# EAGLE design atmega_fusebit_doctor_V2g (EAGLE 5.10)
AUTHOR: PAWEL KISIELEWSKI (MANEKINEN); REV: 2.0
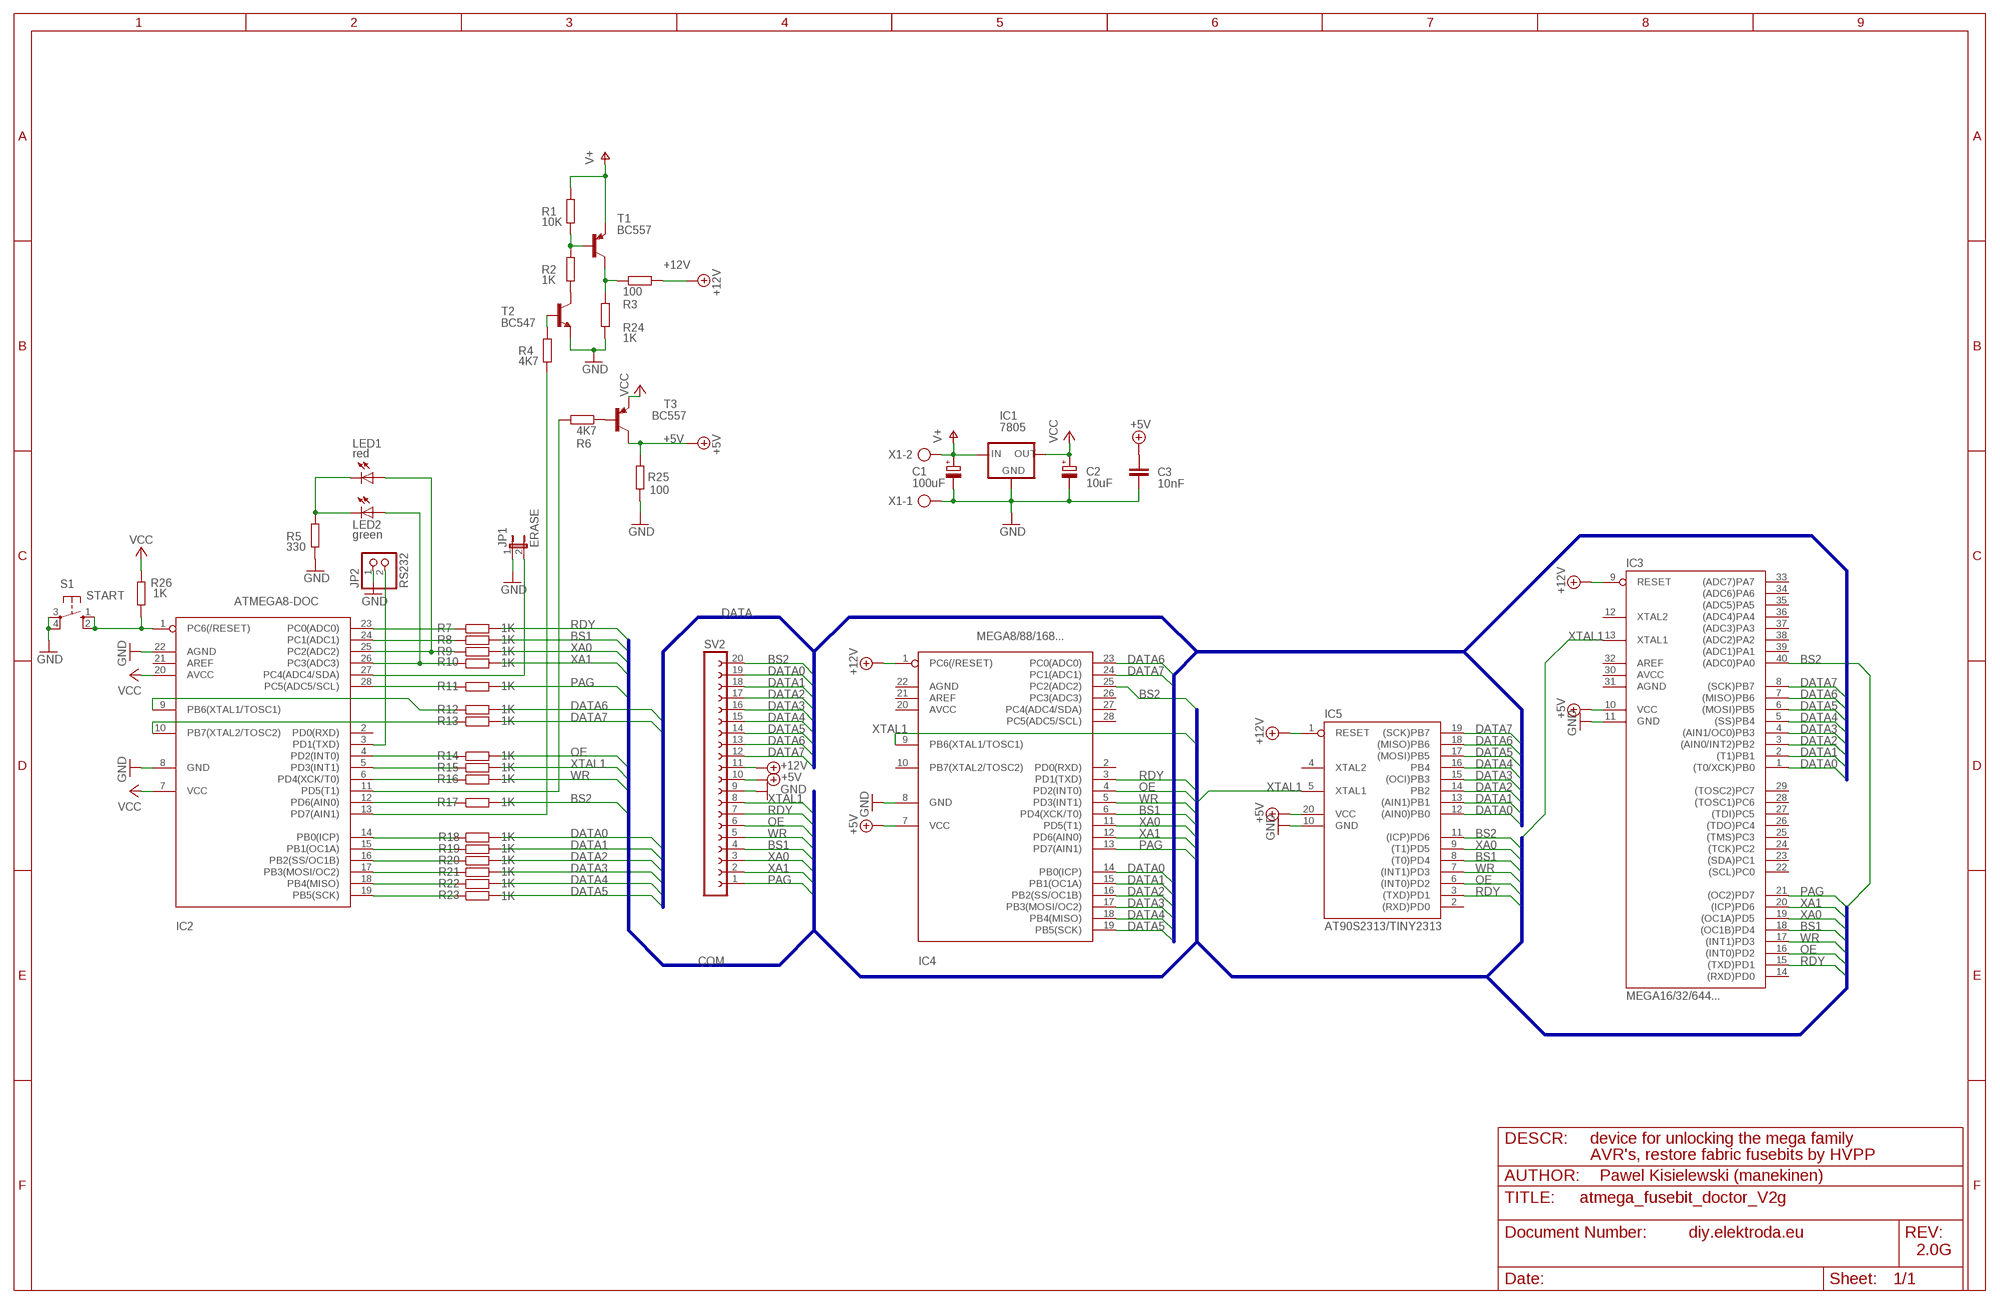
[diagram p0: schematic, sheet 1]

## Parts
C1  100uF  CPOL-EUE2.5-5  [E2,5-5]
C2  10uF  CPOL-EUE2.5-5  [E2,5-5]
C3  10nF  C-EU050-024X044  [C050-024X044]
IC1  7805  78XXL  [78XXL]
IC2  ATMEGA8-DOC  MEGA8-P  [DIL28-3]
IC3  MEGA16/32/644...  MEGA16-P  [DIL40]
IC4  MEGA8/88/168...  MEGA8-P  [DIL28-3]
IC5  AT90S2313/TINY2313  AT90S2313P  [DIL20]
JP1  ERASE  JP1E  [JP1]
JP2  RS232  PINHD-1X2  [1X02]
LED1  red  LED3MM  [LED3MM]
LED2  green  LED3MM  [LED3MM]
R1  10K  R-EU_0204/5  [0204/5]
R2  1K  R-EU_0204/5  [0204/5]
R3  100  R-EU_0204/5  [0204/5]
R4  4K7  R-EU_0204/5  [0204/5]
R5  330  R-EU_0204/5  [0204/5]
R6  4K7  R-EU_0204/5  [0204/5]
R7  1K  R-EU_0204/5  [0204/5]
R8  1K  R-EU_0204/5  [0204/5]
R9  1K  R-EU_0204/5  [0204/5]
R10  1K  R-EU_0204/5  [0204/5]
R11  1K  R-EU_0204/5  [0204/5]
R12  1K  R-EU_0204/5  [0204/5]
R13  1K  R-EU_0204/5  [0204/5]
R14  1K  R-EU_0204/5  [0204/5]
R15  1K  R-EU_0204/5  [0204/5]
R16  1K  R-EU_0204/5  [0204/5]
R17  1K  R-EU_0204/5  [0204/5]
R18  1K  R-EU_0204/5  [0204/5]
R19  1K  R-EU_0204/5  [0204/5]
R20  1K  R-EU_0204/5  [0204/5]
R21  1K  R-EU_0204/5  [0204/5]
R22  1K  R-EU_0204/5  [0204/5]
R23  1K  R-EU_0204/5  [0204/5]
R24  1K  R-EU_0204/5  [0204/5]
R25  100  R-EU_0204/5  [0204/5]
R26  1K  R-EU_0204/5  [0204/5]
S1  START  10-XX  [B3F-10XX]
SV2  FE20-1  [FE20]
T1  BC557  BC557C-PNP-TO92-EBC  [TO92-EBC]
T2  BC547  BC547A-NPN-TO92-EBC  [TO92-EBC]
T3  BC557  BC557C-PNP-TO92-EBC  [TO92-EBC]
X1  AK500/2  [AK500/2]

## Nets
+5V: C3.1 IC3.10(VCC) IC4.7(VCC) IC5.20(VCC) R25.2 SV2.10 T3.C
+12V: IC3.9(RESET) IC4.1(PC6(/RESET)) IC5.1(RESET) R3.2 SV2.11
BS1: IC3.18((OC1B)PD4) IC4.6(PD4(XCK/T0)) IC5.8((T0)PD4) R8.2 SV2.4
BS2: IC3.40((ADC0)PA0) IC4.25(PC2(ADC2)) IC5.11((ICP)PD6) R17.2 SV2.20
DATA0: IC3.1((T0/XCK)PB0) IC4.14(PB0(ICP)) IC5.12((AIN0)PB0) R18.2 SV2.19
DATA1: IC3.2((T1)PB1) IC4.15(PB1(OC1A)) IC5.13((AIN1)PB1) R19.2 SV2.18
DATA2: IC3.3((AIN0/INT2)PB2) IC4.16(PB2(SS/OC1B)) IC5.14(PB2) R20.2 SV2.17
DATA3: IC3.4((AIN1/OC0)PB3) IC4.17(PB3(MOSI/OC2)) IC5.15((OCI)PB3) R21.2 SV2.16
DATA4: IC3.5((SS)PB4) IC4.18(PB4(MISO)) IC5.16(PB4) R22.2 SV2.15
DATA5: IC3.6((MOSI)PB5) IC4.19(PB5(SCK)) IC5.17((MOSI)PB5) R23.2 SV2.14
DATA6: IC3.7((MISO)PB6) IC4.23(PC0(ADC0)) IC5.18((MISO)PB6) R12.2 SV2.13
DATA7: IC3.8((SCK)PB7) IC4.24(PC1(ADC1)) IC5.19((SCK)PB7) R13.2 SV2.12
GND: C1.- C2.- C3.2 IC1.GND IC2.8(GND) IC2.22(AGND) IC3.11(GND) IC4.8(GND) IC5.10(GND) JP1.1 JP2.1 R5.1 R24.1 R25.1 S1.3(P) S1.4(P1) SV2.9 T2.E X1.1
N$1: R6.1 T3.B
N$2: IC2.14(PB0(ICP)) R18.1
N$3: IC2.3(PD1(TXD)) JP2.2
N$4: IC2.28(PC5(ADC5/SCL)) R11.1
N$5: IC2.6(PD4(XCK/T0)) R16.1
N$6: IC2.4(PD2(INT0)) R14.1
N$8: R2.2 T2.C
N$9: IC2.9(PB6(XTAL1/TOSC1)) R12.1
N$10: IC2.10(PB7(XTAL2/TOSC2)) R13.1
N$11: IC2.13(PD7(AIN1)) R4.2
N$12: IC2.11(PD5(T1)) R6.2
N$14: IC2.15(PB1(OC1A)) R19.1
N$16: IC2.16(PB2(SS/OC1B)) R20.1
N$19: IC2.5(PD3(INT1)) R15.1
N$21: IC2.23(PC0(ADC0)) R7.1
N$22: R3.1 R24.2 T1.C
N$24: IC2.17(PB3(MOSI/OC2)) R21.1
N$25: IC2.18(PB4(MISO)) R22.1
N$26: IC2.19(PB5(SCK)) R23.1
N$27: IC2.12(PD6(AIN0)) R17.1
N$29: R4.1 T2.B
N$31: IC2.27(PC4(ADC4/SDA)) JP1.2
N$32: LED1.K(C) LED2.K(C) R5.2
N$34: R1.2 R2.1 T1.B
N$42: IC2.24(PC1(ADC1)) R8.1
N$43: IC2.1(PC6(/RESET)) R26.1 S1.1(S) S1.2(S1)
N$47: IC2.26(PC3(ADC3)) LED2.A R10.1
N$48: IC2.25(PC2(ADC2)) LED1.A R9.1
OE: IC3.16((INT0)PD2) IC4.4(PD2(INT0)) IC5.6((INT0)PD2) R14.2 SV2.6
PAG: IC3.21((OC2)PD7) IC4.13(PD7(AIN1)) R11.2 SV2.1
RDY: IC3.15((TXD)PD1) IC4.3(PD1(TXD)) IC5.3((TXD)PD1) R7.2 SV2.7
V+: C1.+ IC1.IN R1.1 T1.E X1.2
VCC: C2.+ IC1.OUT IC2.7(VCC) IC2.20(AVCC) R26.2 T3.E
WR: IC3.17((INT1)PD3) IC4.5(PD3(INT1)) IC5.7((INT1)PD3) R16.2 SV2.5
XA0: IC3.19((OC1A)PD5) IC4.11(PD5(T1)) IC5.9((T1)PD5) R9.2 SV2.3
XA1: IC3.20((ICP)PD6) IC4.12(PD6(AIN0)) R10.2 SV2.2
XTAL1: IC3.13(XTAL1) IC4.9(PB6(XTAL1/TOSC1)) IC5.5(XTAL1) R15.2 SV2.8
Unconnected: IC2.2(PD0(RXD)) IC2.21(AREF) IC3.12(XTAL2) IC3.14((RXD)PD0) IC3.22((SCL)PC0) IC3.23((SDA)PC1) IC3.24((TCK)PC2) IC3.25((TMS)PC3) IC3.26((TDO)PC4) IC3.27((TDI)PC5) IC3.28((TOSC1)PC6) IC3.29((TOSC2)PC7) IC3.33((ADC7)PA7) IC3.34((ADC6)PA6) IC3.35((ADC5)PA5) IC3.36((ADC4)PA4) IC3.37((ADC3)PA3) IC3.38((ADC2)PA2) IC3.39((ADC1)PA1) IC4.2(PD0(RXD)) IC4.10(PB7(XTAL2/TOSC2)) IC4.20(AVCC) IC4.21(AREF) IC4.22(AGND) IC4.26(PC3(ADC3)) IC4.27(PC4(ADC4/SDA)) IC4.28(PC5(ADC5/SCL)) IC5.2((RXD)PD0) IC5.4(XTAL2)

## Buses
DATA
COM

## Notes on the sheet
- DESCR: | device for unlocking the mega family
- AVR's, restore fabric fusebits by HVPP
- AUTHOR: | Pawel Kisielewski (manekinen)
- diy.elektroda.eu
- 2.0G

## Power pins joined to a net without a drawn wire
AGND: IC3.31(AGND)
AREF: IC3.32(AREF)
AVCC: IC3.30(AVCC)

## Library data of the parts
C1 C2 = rcl:CPOL-EU: POLARIZED CAPACITOR, European symbol
C3 = rcl:C-EU: CAPACITOR, European symbol
IC1 = v-reg:78XXL: VOLTAGE REGULATOR
IC2 IC4 = atmel:MEGA8-P: MICROCONTROLLER 8 Kbytes FLASH 1 kbytes SRAM 512 bytes EEPROM USART 4-channel 10 bit ADC 2-channel 8 bit ADC Source: avr.lbr
IC3 = atmel:MEGA16-P: MICROCONTROLLER 16 Kbytes FLASH 1 kbytes SRAM 512 bytes EEPROM USART 8-channel 10 bit ADC Source: avr.lbr
IC5 = atmel:AT90S2313: MICROCONTROLLER 2 Kbytes FLASH 128 bytes SRAM 128 bytes EEPROM UART
JP1 = jumper:JP1E: JUMPER
JP2 = pinhead:PINHD-1X2: PIN HEADER
LED1 LED2 = led:LED: LED OSRAM: - CHIPLED LG R971, LG N971, LY N971, LG Q971, LY Q971, LO R971, LY R971 LH N974, LH R974 LS Q976, LO Q976, LY Q976 LO Q996 - Hyper CHIPLED LW Q18S LB Q993, LB Q99A, LB R99A - SideLED LS A670, LO A670, LY A670, LG A670, LP A670 LB A673, LV A673, LT A673, LW A673 LH A674 LY A675 LS A676, LA A676, LO A676, LY A676, LW A676 LS A679, LY A679, LG A679 - Hyper Micro SIDELED® LS Y876, LA Y876, LO Y876, LY Y876 LT Y87S - SmartLED LW L88C, LW L88S LB L89C, LB L89S, LG L890 LS L89K, LO L89K, LY L89K LS L896, LA L896, LO L896, LY L896 - TOPLED LS T670, LO T670, LY T670, LG T670, LP T670 LSG T670, LSP T670, LSY T670, LOP T670, LYG T670 LG T671, LOG T671, LSG T671 LB T673, LV T673, LT T673, LW T673 LH T674 LS T676, LA T676, LO T676, LY T676, LB T676, LH T676, LSB T676, LW T676 LB T67C, LV T67C, LT T67C, LS T67K, LO T67K, LY T67K, LW E67C LS E67B, LA E67B, LO E67B, LY E67B, LB E67C, LV E67C, LT E67C LW T67C LS T679, LY T679, LG T679 LS T770, LO T770, LY T770, LG T770, LP T770 LB T773, LV T773, LT T773, LW T773 LH T774 LS E675, LA E675, LY E675, LS T675 LS T776, LA T776, LO T776, LY T776, LB T776 LHGB T686 LT T68C, LB T68C - Hyper Mini TOPLED® LB M676 - Mini TOPLED Santana® LG M470 LS M47K, LO M47K, LY M47K Source: http://www.osram.convergy.de - LUMILED® LXK2-PW12-R00, LXK2-PW12-S00, LXK2-PW14-U00, LXK2-PW14-V00 LXK2-PM12-R00, LXK2-PM12-S00, LXK2-PM14-U00 LXK2-PE12-Q00, LXK2-PE12-R00, LXK2-PE12-S00, LXK2-PE14-T00, LXK2-PE14-U00 LXK2-PB12-K00, LXK2-PB12-L00, LXK2-PB12-M00, LXK2-PB14-N00, LXK2-PB14-P00, LXK2-PB14-Q00 LXK2-PR12-L00, LXK2-PR12-M00, LXK2-PR14-Q00, LXK2-PR14-R00 LXK2-PD12-Q00, LXK2-PD12-R00, LXK2-PD12-S00 LXK2-PH12-R00, LXK2-PH12-S00 LXK2-PL12-P00, LXK2-PL12-Q00, LXK2-PL12-R00 Source: www.luxeon.com
R1-R26 = rcl:R-EU_: RESISTOR, European symbol
S1 = switch-omron:10-XX: OMRON SWITCH
SV2 = con-lsta:FE20-1: FEMALE HEADER
T1 T3 = transistor:*-PNP-: PNP Transistror
T2 = transistor:*-NPN-: NPN Transistror
X1 = con-ptr500:AK500/2: CONNECTOR

## Board
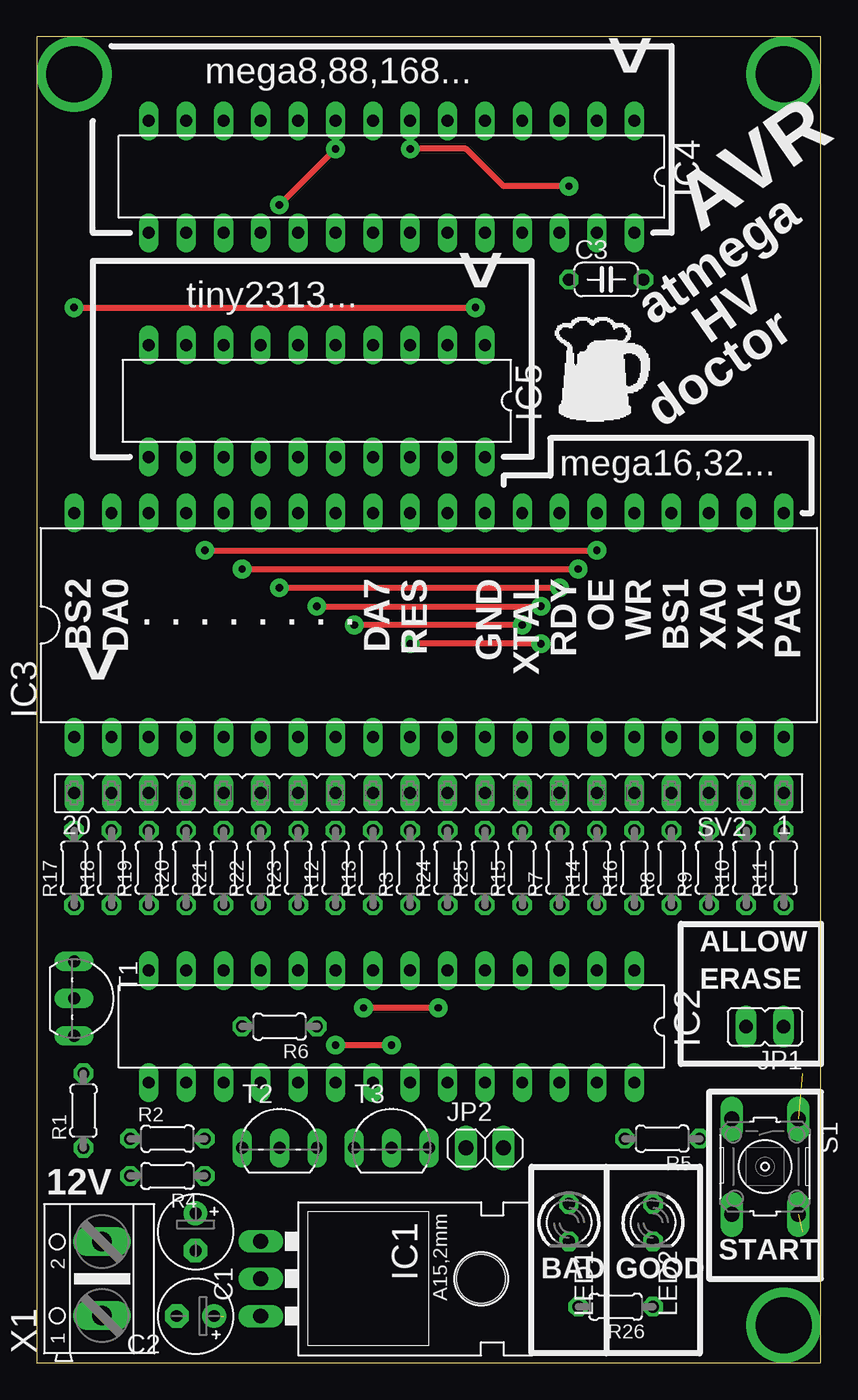
[diagram p1: board, top side]
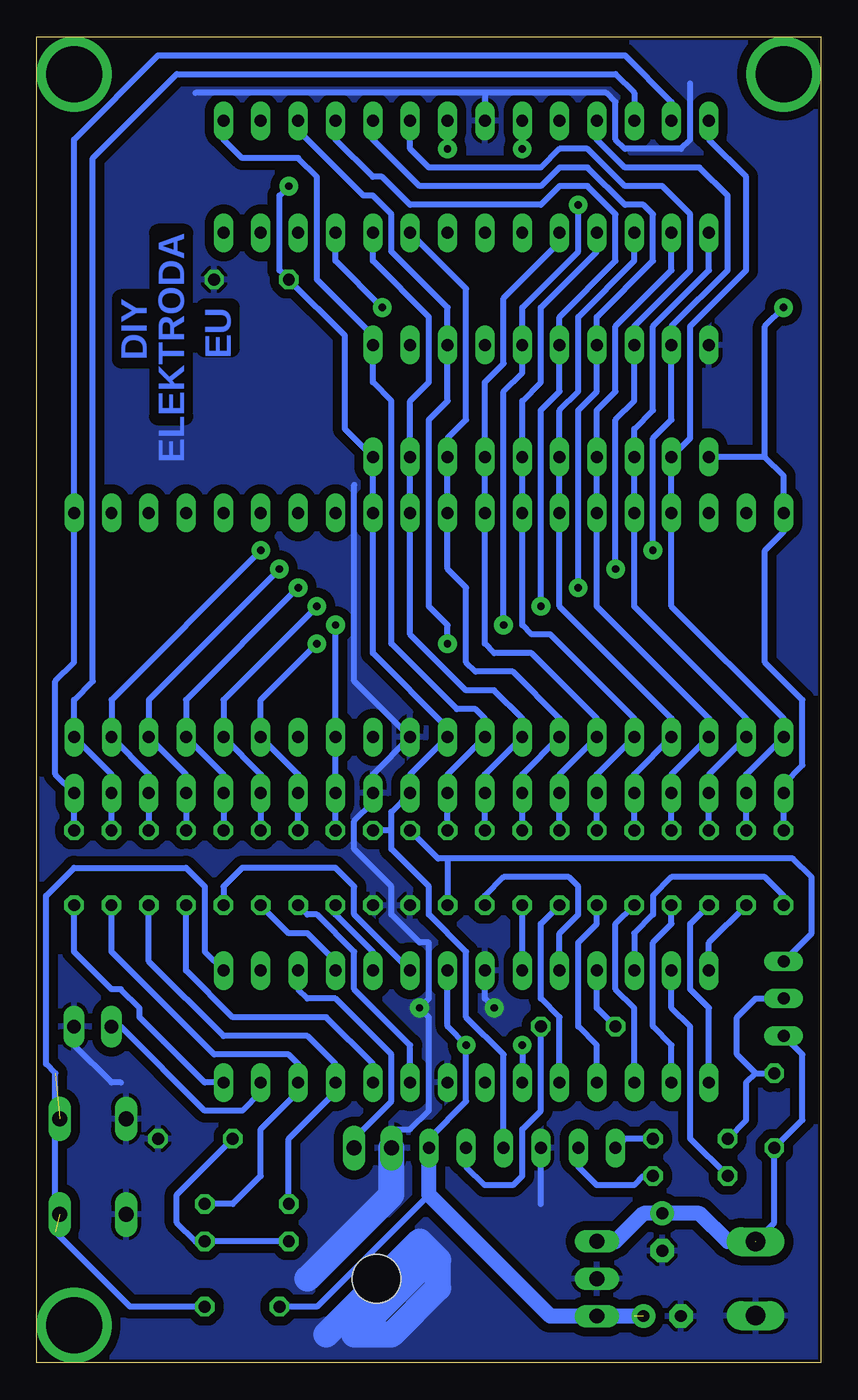
[diagram p2: board, bottom side, seen from below]

Size 53.33 x 90.16 mm. Coordinates in mm from the lower left corner, seen from the top.
Outline: 0,90.16 0,0 53.33,0 53.33,90.16 0,90.16
Copper layers (1*16): Top 0.035mm / dielectric 1.5mm / Bottom 0.035mm
Design rules "default *": minimum track width 10mil, minimum drill 24mil, track to track 24mil, track to pad 24mil, pad to pad 8mil, via to via 8mil, smd to smd 8mil, copper to edge 8mil, drill to drill 8mil, minimum pad ring 10mil, minimum via ring 8mil, stop-mask expansion 4mil, vias tented up to drill 0mil, thermal gap 10mil

### Footprints (pad centres in the part's own frame; a part is rotated, then mirrored left to right if it is on the bottom)
E2,5-5 = drill 0.813 pad 1.6 round: + -1.27,0 | drill 0.813 pad 1.6 octagon: - 1.27,0
C050-024X044 = drill 0.813 octagon: 1 -2.54,0; 2 2.54,0
78XXL = drill 1.016 long: GND 0,-3.81; IN -2.54,-3.81; OUT 2.54,-3.81 | hole 3.302: 0,11.176
DIL28-3 = drill 0.813 long: 1 -16.51,-3.81; 2 -13.97,-3.81; 3 -11.43,-3.81; 4 -8.89,-3.81; 5 -6.35,-3.81; 6 -3.81,-3.81; 7 -1.27,-3.81; 8 1.27,-3.81; 9 3.81,-3.81; 10 6.35,-3.81; 11 8.89,-3.81; 12 11.43,-3.81; 13 13.97,-3.81; 14 16.51,-3.81; 15 16.51,3.81; 16 13.97,3.81; 17 11.43,3.81; 18 8.89,3.81; 19 6.35,3.81; 20 3.81,3.81; 21 1.27,3.81; 22 -1.27,3.81; 23 -3.81,3.81; 24 -6.35,3.81; 25 -8.89,3.81; 26 -11.43,3.81; 27 -13.97,3.81; 28 -16.51,3.81
DIL40 = drill 0.813 long: 1 -24.13,-7.62; 2 -21.59,-7.62; 3 -19.05,-7.62; 4 -16.51,-7.62; 5 -13.97,-7.62; 6 -11.43,-7.62; 7 -8.89,-7.62; 8 -6.35,-7.62; 9 -3.81,-7.62; 10 -1.27,-7.62; 11 1.27,-7.62; 12 3.81,-7.62; 13 6.35,-7.62; 14 8.89,-7.62; 15 11.43,-7.62; 16 13.97,-7.62; 17 16.51,-7.62; 18 19.05,-7.62; 19 21.59,-7.62; 20 24.13,-7.62; 21 24.13,7.62; 22 21.59,7.62; 23 19.05,7.62; 24 16.51,7.62; 25 13.97,7.62; 26 11.43,7.62; 27 8.89,7.62; 28 6.35,7.62; 29 3.81,7.62; 30 1.27,7.62; 31 -1.27,7.62; 32 -3.81,7.62; 33 -6.35,7.62; 34 -8.89,7.62; 35 -11.43,7.62; 36 -13.97,7.62; 37 -16.51,7.62; 38 -19.05,7.62; 39 -21.59,7.62; 40 -24.13,7.62
DIL20 = drill 0.813 long: 1 -11.43,-3.81; 2 -8.89,-3.81; 3 -6.35,-3.81; 4 -3.81,-3.81; 5 -1.27,-3.81; 6 1.27,-3.81; 7 3.81,-3.81; 8 6.35,-3.81; 9 8.89,-3.81; 10 11.43,-3.81; 11 11.43,3.81; 12 8.89,3.81; 13 6.35,3.81; 14 3.81,3.81; 15 1.27,3.81; 16 -1.27,3.81; 17 -3.81,3.81; 18 -6.35,3.81; 19 -8.89,3.81; 20 -11.43,3.81
JP1 = drill 0.914 long: 1 0,-1.27; 2 0,1.27
1X02 = drill 1.016 long: 1 -1.27,0; 2 1.27,0
LED3MM = drill 0.813 octagon: A -1.27,0; K 1.27,0
0204/5 = drill 0.813 octagon: 1 -2.54,0; 2 2.54,0
B3F-10XX = drill 1.016 long: 1 -3.251,2.261; 2 3.251,2.261; 3 -3.251,-2.261; 4 3.251,-2.261
FE20 = drill 0.813 long: 1 -24.13,0; 2 -21.59,0; 3 -19.05,0; 4 -16.51,0; 5 -13.97,0; 6 -11.43,0; 7 -8.89,0; 8 -6.35,0; 9 -3.81,0; 10 -1.27,0; 11 1.27,0; 12 3.81,0; 13 6.35,0; 14 8.89,0; 15 11.43,0; 16 13.97,0; 17 16.51,0; 18 19.05,0; 19 21.59,0; 20 24.13,0
TO92-EBC = drill 0.813 long: B 0,-1.27; C -2.54,-1.27; E 2.54,-1.27
AK500/2 = drill 1.321 long: 1 -2.515,0; 2 2.515,0

### Placement (x,y rotation side)
C1  10.79,8.88 270 top
C2  10.79,3.17 180 top
C3  38.73,73.65 0 top
IC1  19.05,5.71 270 top
IC2  24.13,22.85 180 top
IC3  26.67,50.16 0 top
IC4  24.13,80.64 180 top
IC5  19.05,65.39 180 top
JP1  49.53,22.85 90 top
JP2  30.48,14.59 0 top
LED1  36.2,9.52 270 top
LED2  41.91,9.52 270 top
R1  3.17,17.14 90 top
R2  8.89,15.23 0 top
R3  25.4,33.65 90 top
R4  8.89,12.69 180 top
R5  42.55,15.23 180 top
R6  16.51,22.85 180 top
R7  35.56,33.65 90 top
R8  43.18,33.65 90 top
R9  45.72,33.65 90 top
R10  48.26,33.65 90 top
R11  50.8,33.65 90 top
R12  20.32,33.65 90 top
R13  22.86,33.65 90 top
R14  38.1,33.65 90 top
R15  33.02,33.65 90 top
R16  40.64,33.65 90 top
R17  2.54,33.65 90 top
R18  5.08,33.65 90 top
R19  7.62,33.65 90 top
R20  10.16,33.65 90 top
R21  12.7,33.65 90 top
R22  15.24,33.65 90 top
R23  17.78,33.65 90 top
R24  27.94,33.65 90 top
R25  30.48,33.65 90 top
R26  39.37,3.8 180 top
S1  49.53,13.32 270 top
SV2  26.67,38.73 180 top
T1  3.81,24.75 270 top
T2  16.51,15.86 0 top
T3  24.13,15.86 0 top
X1  4.45,5.71 90 top

### Tracks (layer width: path | path; a pad name or v marks a point on that pad's centre or on a via)
+5V  (via drill 0.5 pad 1.27)
  Top 0.406: v36.2,80 31.75,80 29.21,82.54 v25.4,82.54
  Bottom 0.406: v25.4,82.54 IC4.7 | v36.2,80 36.83,79.37 36.83,74.29 C3.1 32.38,69.84 32.38,63.49 IC5.20 30.48,48.25 25.4,43.17 IC3.10 27.94,39.99 SV2.10 29.21,37.45 29.21,36.19 | 29.21,36.19 29.21,34.91 26.67,32.38 26.67,30.47 24.13,27.93 24.13,23.48 21.59,20.95 T3.C | 29.21,36.19 R25.2
+12V
  Bottom 0.406: IC4.1 40.64,83.18 39.37,81.91 35.56,81.91 34.29,80.64 34.29,73.65 30.48,69.84 IC5.1 30.48,66.67 29.21,65.39 29.21,48.88 24.77,44.44 23.5,44.44 22.86,43.8 IC3.9 25.4,39.99 SV2.11 | SV2.11 25.4,38.09 | R3.2 SV2.11
BS1  (via drill 0.5 pad 1.27)
  Top 0.406: v13.97,53.96 v36.83,53.96
  Bottom 0.406: IC4.6 27.94,82.54 26.67,81.27 19.05,81.27 17.78,82.54 15.88,82.54 13.34,80 10.79,80 8.89,78.1 8.89,74.29 12.7,70.48 IC5.8 12.7,65.39 13.97,64.12 v13.97,53.96 | v36.83,53.96 45.72,45.07 IC3.18 43.18,39.99 SV2.4 R8.2
BS2  (via drill 0.5 pad 1.27)
  Top 0.406: v2.54,71.75 v29.84,71.75
  Bottom 0.406: v2.54,71.75 3.81,70.48 3.81,61.59 | IC4.25 33.02,74.92 v29.84,71.75 | 3.81,61.59 2.54,60.31 IC3.40 2.54,56.51 3.81,55.23 3.81,47.62 1.27,45.07 1.27,40.63 2.54,39.36 SV2.20 R17.2 | 3.81,61.59 IC5.11
DATA0
  Bottom 0.406: IC4.14 7.62,83.18 5.08,80.64 5.08,74.29 8.89,70.48 8.89,62.85 IC5.12 10.16,51.42 2.54,43.8 IC3.1 5.08,39.99 SV2.19 R18.2
DATA1
  Bottom 0.406: IC4.15 7.62,74.29 11.43,70.48 11.43,64.76 12.7,63.49 IC5.13 12.7,51.42 5.08,43.8 IC3.2 7.62,39.99 SV2.18 R19.2
DATA2
  Bottom 0.406: IC4.16 10.16,74.29 13.97,70.48 13.97,66.03 15.24,64.76 IC5.14 15.24,51.42 7.62,43.8 IC3.3 10.16,39.99 SV2.17 R20.2
DATA3
  Bottom 0.406: IC4.17 12.7,74.92 16.51,71.11 16.51,66.03 17.78,64.76 IC5.15 17.78,51.42 10.16,43.8 IC3.4 12.7,39.99 SV2.16 R21.2
DATA4
  Bottom 0.406: IC4.18 15.24,75.56 19.05,71.75 19.05,66.67 20.32,65.39 IC5.16 20.32,50.16 19.68,49.52 18.41,49.52 12.7,43.8 IC3.5 15.24,39.99 SV2.15 R22.2
DATA5
  Bottom 0.406: IC4.19 17.78,76.19 21.59,72.38 21.59,67.94 22.86,66.67 IC5.17 22.86,48.88 22.23,48.25 19.68,48.25 15.24,43.8 IC3.6 17.78,39.99 SV2.14 R23.2
DATA6
  Bottom 0.406: IC4.23 24.13,73.02 24.13,64.12 25.4,62.85 IC5.18 25.4,53.96 24.13,52.7 24.13,47.62 23.5,46.98 20.95,46.98 17.78,43.8 IC3.7 20.32,39.99 SV2.13 R12.2
DATA7
  Bottom 0.406: IC4.24 30.48,74.92 26.67,71.11 26.67,66.67 27.94,65.39 IC5.19 27.94,49.52 24.13,45.71 22.23,45.71 20.32,43.8 IC3.8 22.86,39.99 SV2.12 R13.2
GND  (via drill 0.5 pad 1.27)
  Top 0.406: v27.3,24.12 v22.23,24.12
  Bottom 0.406: 31.75,59.68 31.75,46.34 IC3.11 30.48,39.99 SV2.9 30.48,38.09 31.75,36.82 31.75,34.91 29.21,32.38 29.21,30.47 27.3,28.56 26.67,28.56 26.67,24.75 v27.3,24.12 26.67,23.48 26.67,17.14 27.94,15.86 29.21,15.86 JP2.1 | 8.89,86.98 8.89,83.18 9.53,82.54 13.34,82.54 13.97,83.18 13.97,85.72 14.61,86.35 22.86,86.35 | v22.23,24.12 22.86,24.75 IC2.8 | 22.86,86.35 IC4.8 | 22.86,86.35 42.55,86.35 | 19.05,10.79 T2.E | JP1.1 50.8,21.58 48.26,19.04 47.62,19.04
  Bottom 1.778: JP2.1 29.21,11.42 34.92,5.71 | 33.66,1.9 27.3,8.25 26.04,6.97 26.04,5.07 29.21,1.9 31.75,1.9 27.3,6.34
  pour Bottom: 53.34,90.16 0,90.16 0,-0.01 53.34,-0.01
N$1
  Bottom 0.406: R6.1 19.05,17.14 20.32,15.86 20.32,12.69 20.95,12.05 22.86,12.05 24.13,13.32 T3.B
N$2
  Bottom 0.406: R18.1 7.62,28.56 IC2.14
N$3
  Bottom 0.406: IC2.3 35.56,25.39 34.92,24.75 33.02,24.75 29.21,20.95 29.21,17.77 31.75,15.23 JP2.2
N$4
  Bottom 0.406: R11.1 50.8,27.93 48.26,25.39 47.62,25.39 46.35,24.12 46.35,23.48 41.91,19.04 IC2.28
N$5
  Bottom 0.406: R16.1 40.64,32.38 39.37,33.65 33.02,33.65 31.75,32.38 31.75,30.47 IC2.6
N$6
  Bottom 0.406: R14.1 36.2,29.2 34.92,29.2 33.02,27.29 IC2.4
N$8
  Bottom 0.406: R2.2 13.34,15.23 T2.C
N$9
  Bottom 0.406: IC2.9 R12.1
N$10
  Bottom 0.406: IC2.10 17.78,29.2 16.51,30.47 16.51,32.38 17.14,33.01 21.59,33.01 22.86,31.74 R13.1
N$11
  Bottom 0.406: R4.2 8.89,15.23 8.89,22.85 10.16,24.12 IC2.13
N$12
  Bottom 0.406: R6.2 15.24,24.12 IC2.11
N$13  (via drill 3.81 pad 5.08)
  other vias: 50.8,2.53
N$14
  Bottom 0.406: R19.1 8.89,29.84 8.89,25.39 7.62,24.12 IC2.15
N$15  (via drill 3.81 pad 5.08)
  other vias: 50.8,87.62
N$16
  Bottom 0.406: R20.1 10.16,29.84 11.43,28.56 11.43,22.85 10.16,21.58 IC2.16
N$17  (via drill 3.81 pad 5.08)
  other vias: 2.54,87.62
N$19
  Bottom 0.406: R15.1 33.02,30.47 30.48,27.93 IC2.5
N$21
  Bottom 0.406: R7.1 34.92,30.47 34.29,30.47 31.75,27.93 31.75,25.39 27.94,21.58 IC2.23
N$22
  Bottom 0.406: 25.4,34.28 R3.1 | 25.4,34.28 1.91,34.28 0.64,33.01 0.64,29.2 T1.C | 25.4,34.28 26.04,34.28 R24.2
N$24
  Bottom 0.406: R21.1 13.97,29.84 13.97,25.39 12.7,24.12 IC2.17
N$25
  Bottom 0.406: R22.1 15.24,29.84 16.51,28.56 16.51,22.85 15.24,21.58 IC2.18
N$26
  Bottom 0.406: R23.1 19.05,29.84 19.05,24.75 17.78,23.48 IC2.19
N$27
  Bottom 0.406: R17.1 2.54,31.74 3.81,33.01 10.16,33.01 11.43,31.74 11.43,30.47 12.7,29.2 IC2.12
N$29
  Bottom 0.406: R4.1 12.06,12.69 12.7,12.05 15.24,12.05 16.51,13.32 T2.B
N$31
  Bottom 0.406: IC2.27 38.1,18.41 39.37,17.14 41.91,17.14 47.62,22.85 JP1.2
N$32
  Bottom 0.406: LED2.K LED1.K LED2.K | LED2.K 42.55,8.25 43.81,9.52 43.81,11.42 R5.2
N$34
  Bottom 0.406: T1.B 4.45,24.75 5.71,23.48 5.71,20.95 4.45,19.68 | R2.1 5.08,16.5 5.08,19.04 4.45,19.68 | 4.45,19.68 R1.2
N$42
  Bottom 0.406: R8.1 43.18,26.66 40.01,23.48 33.66,23.48 30.48,20.31 IC2.24
N$43  (2 unrouted)
  Bottom 0.406: IC2.1 41.91,27.93 41.91,32.38 43.18,33.65 50.8,33.65 52.7,31.74 52.7,20.31 52.07,19.68 52.07,8.88 46.99,3.8 R26.1
N$47
  Bottom 0.406: LED2.A 40.01,10.79 38.1,12.69 38.1,15.86 35.56,18.41 IC2.26 35.56,20.31 36.2,20.95 41.27,20.95 48.26,27.93 R10.1
N$48
  Bottom 0.406: R9.1 45.72,27.29 40.64,22.21 34.92,22.21 33.02,20.31 IC2.25 33.02,18.41 36.2,15.23 LED1.A
OE  (via drill 0.5 pad 1.27)
  Top 0.406: v19.05,51.42 v34.29,51.42
  Bottom 0.406: IC4.4 33.02,83.18 30.48,80.64 29.84,80.64 27.94,78.73 19.05,78.73 17.78,80 15.88,80 13.97,78.1 13.97,74.92 17.78,71.11 IC5.6 17.78,66.03 19.05,64.76 v19.05,51.42 | v34.29,51.42 40.64,45.07 IC3.16 38.1,39.99 SV2.6 R14.2
PAG
  Bottom 0.406: IC4.13 10.16,85.72 13.34,88.89 45.09,88.89 50.8,83.18 IC3.21 50.8,47.62 52.07,46.34 52.07,39.99 SV2.1 R11.2
RDY  (via drill 0.5 pad 1.27)
  Top 0.406: v34.29,48.88 v25.4,48.88
  Bottom 0.406: IC4.3 35.56,83.81 31.11,79.37 30.48,79.37 29.21,78.1 29.21,75.56 25.4,71.75 IC5.3 25.4,65.39 26.67,64.12 26.67,51.42 25.4,50.16 v25.4,48.88 | v34.29,48.88 38.1,45.07 IC3.15 35.56,39.99 SV2.7 R7.2
V+  (1 unrouted)
  Bottom 0.406: T1.E 1.27,20.95 1.27,16.5 R1.1 3.17,9.52 4.45,8.25
  Bottom 1.016: 4.45,8.25 6.35,8.25 8.26,10.15 C1.+ 12.06,10.15 13.97,8.25 IC1.IN
VCC  (via drill 0.5 pad 1.27)  (1 unrouted)
  Top 0.406: v24.13,21.58 v20.32,21.58
  Bottom 0.406: IC2.7 25.4,22.85 v24.13,21.58 24.13,17.77 26.67,15.23 T3.E | v20.32,21.58 IC2.20 | R26.2 34.29,3.8 26.67,11.42
  Bottom 1.016: T3.E 26.67,11.42 18.41,3.17 IC1.OUT 12.7,3.17
WR  (via drill 0.5 pad 1.27)
  Top 0.406: v16.51,52.7 v35.56,52.7
  Bottom 0.406: v16.51,52.7 16.51,64.76 15.24,66.03 IC5.7 15.24,71.11 11.43,74.92 11.43,78.1 12.06,78.73 13.34,78.73 15.88,81.27 17.78,81.27 19.05,80 27.3,80 30.48,83.18 IC4.5 | v35.56,52.7 43.18,45.07 IC3.17 40.64,39.99 SV2.5 R16.2
XA0  (via drill 0.5 pad 1.27)
  Top 0.406: v11.43,55.23 v38.1,55.23
  Bottom 0.406: IC4.11 15.24,83.18 13.34,81.27 8.26,81.27 6.35,79.37 6.35,74.29 10.16,70.48 IC5.9 10.16,64.12 11.43,62.85 v11.43,55.23 | v38.1,55.23 48.26,45.07 IC3.19 45.72,39.99 SV2.3 R9.2
XA1
  Bottom 0.406: IC4.12 12.7,86.35 13.97,87.62 43.81,87.62 49.53,81.91 49.53,46.34 50.8,45.07 IC3.20 48.26,39.99 SV2.2 R10.2
XTAL1  (via drill 0.5 pad 1.27)
  Top 0.406: v16.51,78.73 v20.32,82.54 | v33.02,50.16 v21.59,50.16
  Bottom 0.406: v20.32,82.54 IC4.9 | v16.51,78.73 16.51,75.56 20.32,71.75 IC5.5 20.32,67.3 21.59,66.03 v21.59,50.16 | v33.02,50.16 IC3.13 SV2.8 R15.2

### Text on the board
Bottom: ELEKTRODA | EU | DIY
tPlace: ^ | mega8,88,168... | ^ | AVR | tiny2313... | atmega | HV | doctor | mega16,32... | BS2 | DA0 | DA7 | RES | GND | XTAL | RDY | OE | WR | BS1 | XA0 | XA1 | PAG | ^ | . . . . . . . . | ALLOW | ERASE | 12V | START | BAD | GOOD